# Altium schematic sheet regu.SchDoc
size A4
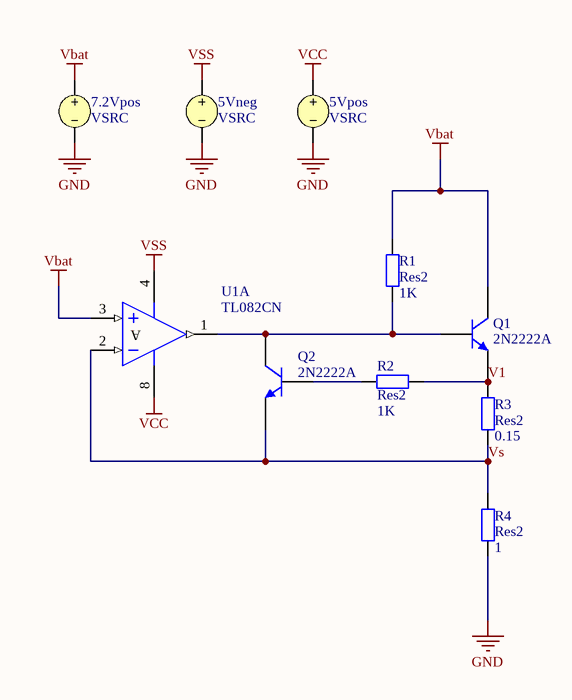
[diagram p0: regu.SchDoc]

## Parts
5Vneg  VSRC
5Vpos  VSRC
7.2Vpos  VSRC
Q1  2N2222A  [TO-18]
Q2  2N2222A  [TO-18]
R1  Res2  value 1K  [res5_1/4W]
R2  Res2  value 1K  [res5_1/4W]
R3  Res2  value 0.15  [res5_1/4W]
R4  Res2  value 1  [res5_1/4W]
U1  TL082CN  [DIP8]  (part A of 2)

## Nets
GND: 5Vneg.2 5Vpos.2 7.2Vpos.2 R4.1
Vbat: 7.2Vpos.1 Q1.2(C) R1.2 U1.3(IN+)
VCC: 5Vpos.1 U1.8(V+)
VSS: 5Vneg.1 U1.4(V-)
V1: Q1.3(E) R2.2 R3.2
Vs: Q2.3(E) R3.1 R4.2 U1.2(IN-)
NetQ1_1: Q1.1(B) Q2.2(C) R1.1 U1.1(OUT)
NetQ2_1: Q2.1(B) R2.1

## Notes on the sheet
- (in symbol TL082CN, part A) A

## Library data of the parts
5Vneg = VSRC: Voltage Source; Note: PCB Footprint - Not required; Value: -5; Published: 8-Jun-2000; LatestRevisionDate: 17-Jul-2002; LatestRevisionNote: Re-released for DXP Platform.; PackageReference: Not Applicable; Publisher: Altium Limited
5Vpos = VSRC: Voltage Source; Note: PCB Footprint - Not required; Value: +5; Published: 8-Jun-2000; LatestRevisionDate: 17-Jul-2002; LatestRevisionNote: Re-released for DXP Platform.; PackageReference: Not Applicable; Publisher: Altium Limited
7.2Vpos = VSRC: Voltage Source; Note: PCB Footprint - Not required; Value: +7.2; Published: 8-Jun-2000; LatestRevisionDate: 17-Jul-2002; LatestRevisionNote: Re-released for DXP Platform.; PackageReference: Not Applicable; Publisher: Altium Limited
Q1 Q2 = 2N2222A: High Speed Switches; Published: 8-Jun-2000; LatestRevisionDate: 11-Dec-2002; LatestRevisionNote: Sim Port Map correction; DatasheetVersion: Jun-1999; PackageReference: TO-18; Publisher: Altium Limited; PackageDescription: Can; 3 Leads; Pin Circle Dia. 2.54 mm; Lead Dia. 0.49 mm (max); ComponentLink1Description: Manufacturer Link; ComponentLink1URL: http://www.st.com/; ComponentLink2Description: Datasheet; ComponentLink2URL: http://www.st.com/stonline/products/literature/ds/9288/2n2219a.pdf
R1-R4 = Res2: Resistor; Published: 8-Jun-2000; LatestRevisionDate: 17-Jul-2002; LatestRevisionNote: Re-released for DXP Platform.; PackageReference: AXIAL-0.4; Publisher: Altium Limited
U1 = TL082CN: General-Purpose J-FET Dual Operational Amplifier; Published: 24-Aug-2001; LatestRevisionDate: 06-Jun-2005; LatestRevisionNote: Stylized 3D Model Added.; DatasheetVersion: Jan-1999; PackageReference: DIP8; Publisher: Altium Limited; PackageDescription: DIP; 8 Leads; Row Spacing 7.62 mm; Pitch 2.54 mm; Code_JEDEC: MO-001-AN; ComponentLink1Description: Manufacturer Link; ComponentLink1URL: http://www.st.com/; ComponentLink2Description: Datasheet; ComponentLink2URL: http://www.st.com/stonline/products/literature/ds/2300/tl082.pdf